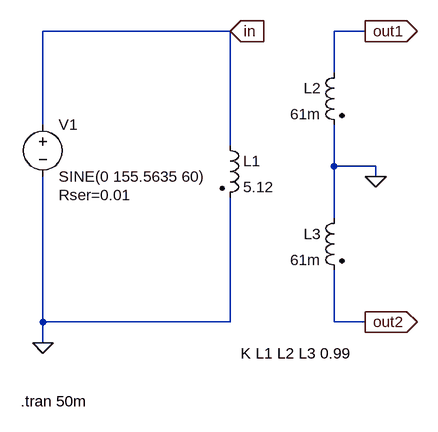
[diagram p0: schematic Power_Transformer.asc]
Power_Transformer.asc, the LTspice schematic file:
Version 4
SHEET 1 880 680
WIRE 256 -32 -32 -32
WIRE 464 -32 416 -32
WIRE 416 32 416 -32
WIRE -32 112 -32 -32
WIRE 256 144 256 -32
WIRE 416 176 416 112
WIRE 480 176 416 176
WIRE 480 192 480 176
WIRE 416 256 416 176
WIRE -32 416 -32 192
WIRE 256 416 256 224
WIRE 256 416 -32 416
WIRE 416 416 416 336
WIRE 464 416 416 416
WIRE -32 448 -32 416
FLAG -32 448 0
FLAG 480 192 0
FLAG 256 -32 in
IOPIN 256 -32 In
FLAG 464 -32 out1
IOPIN 464 -32 Out
FLAG 464 416 out2
IOPIN 464 416 Out
SYMBOL voltage -32 96 R0
WINDOW 123 0 0 Left 0
WINDOW 39 24 124 Left 2
SYMATTR InstName V1
SYMATTR Value SINE(0 155.5635 60)
SYMATTR SpiceLine Rser=0.01
SYMBOL ind2 240 128 R0
SYMATTR InstName L1
SYMATTR Value 5.12
SYMATTR Type ind
SYMBOL ind2 432 16 M0
SYMATTR InstName L2
SYMATTR Value 61m
SYMATTR Type ind
SYMBOL ind2 432 240 M0
SYMATTR InstName L3
SYMATTR Value 61m
SYMATTR Type ind
TEXT 272 464 Left 2 !K L1 L2 L3 0.99
TEXT -66 538 Left 2 !.tran 50m

The netlist it stands for:
* Power_Transformer.asc
V1 in 0 SINE(0 155.5635 60) Rser=0.01
L1 in 0 5.12
L2 out1 0 61m
L3 0 out2 61m
K L1 L2 L3 0.99
.tran 50m
.backanno
.end